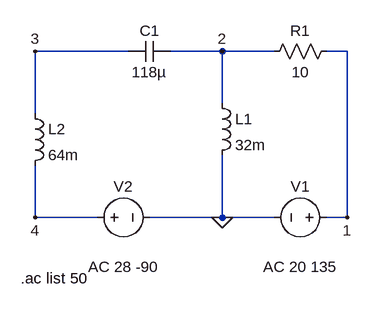
[diagram p0: schematic ex2.asc]
ex2.asc, the LTspice schematic file:
Version 4
SHEET 1 880 680
WIRE -64 32 -208 32
WIRE 80 32 0 32
WIRE 160 32 80 32
WIRE 272 32 240 32
WIRE 80 112 80 32
WIRE -208 128 -208 32
WIRE -208 288 -208 208
WIRE -112 288 -208 288
WIRE 80 288 80 192
WIRE 80 288 -32 288
WIRE 160 288 80 288
WIRE 272 288 272 32
WIRE 272 288 240 288
FLAG 80 288 0
FLAG 272 288 1
FLAG 80 32 2
FLAG -208 32 3
FLAG -208 288 4
SYMBOL res 256 16 R90
WINDOW 0 0 56 VBottom 2
WINDOW 3 32 56 VTop 2
SYMATTR InstName R1
SYMATTR Value 10
SYMBOL cap 0 16 R90
WINDOW 0 0 32 VBottom 2
WINDOW 3 32 32 VTop 2
SYMATTR InstName C1
SYMATTR Value 118µ
SYMBOL voltage 256 288 R90
WINDOW 0 -32 56 VBottom 2
WINDOW 3 32 56 VTop 2
WINDOW 123 60 56 VTop 2
WINDOW 39 0 0 Left 0
SYMATTR InstName V1
SYMATTR Value ""
SYMATTR Value2 AC 20 135
SYMBOL voltage -128 288 R270
WINDOW 0 32 56 VTop 2
WINDOW 3 -32 56 VBottom 2
WINDOW 123 -60 56 VBottom 2
WINDOW 39 0 0 Left 0
SYMATTR InstName V2
SYMATTR Value ""
SYMATTR Value2 AC 28 -90
SYMBOL ind 64 96 R0
SYMATTR InstName L1
SYMATTR Value 32m
SYMBOL ind -224 112 R0
SYMATTR InstName L2
SYMATTR Value 64m
TEXT -230 382 Left 2 !.ac list 50

The netlist it stands for:
* ex2.asc
R1 1 2 10
C1 2 3 118µ
V1 1 0 AC 20 135
V2 4 0 AC 28 -90
L1 2 0 32m
L2 3 4 64m
.ac list 50
.backanno
.end

* Results of the author's LTspice run, read from the files saved beside the schematic
* AC Analysis:
*   frequency = 50 
*   V(1) = -14.14 V
*   V(2) = 27.32 V
*   V(3) = -79.98 V
*   V(4) = 3.553 fV
*   I(C1) = -4.3 A
*   I(L2) = -4.3 A
*   I(L1) = 153.4 mA
*   I(R1) = -4.146 A
*   I(V2) = -4.3 A
*   I(V1) = 4.146 A